# Altium schematic sheet Telemetry_System.SchDoc
size A3; PageSetup: Record=PageOptions|CenterHorizontal=True|CenterVertical=True|PrintScale=0.49|XCorrection=1.00|YCorrection=1.00|PrintKind=0|BorderSize=5000000|LeftOffset=0|BottomOffset=0|Orientation=2|PaperLength=1000|PaperWidth=1000|Scale=100|PaperSource=7|PrintQuality=600|MediaType=1|DitherType=10|PaperKind=A3|PrintScaleMode=1; SheetTitle: Sheet Title
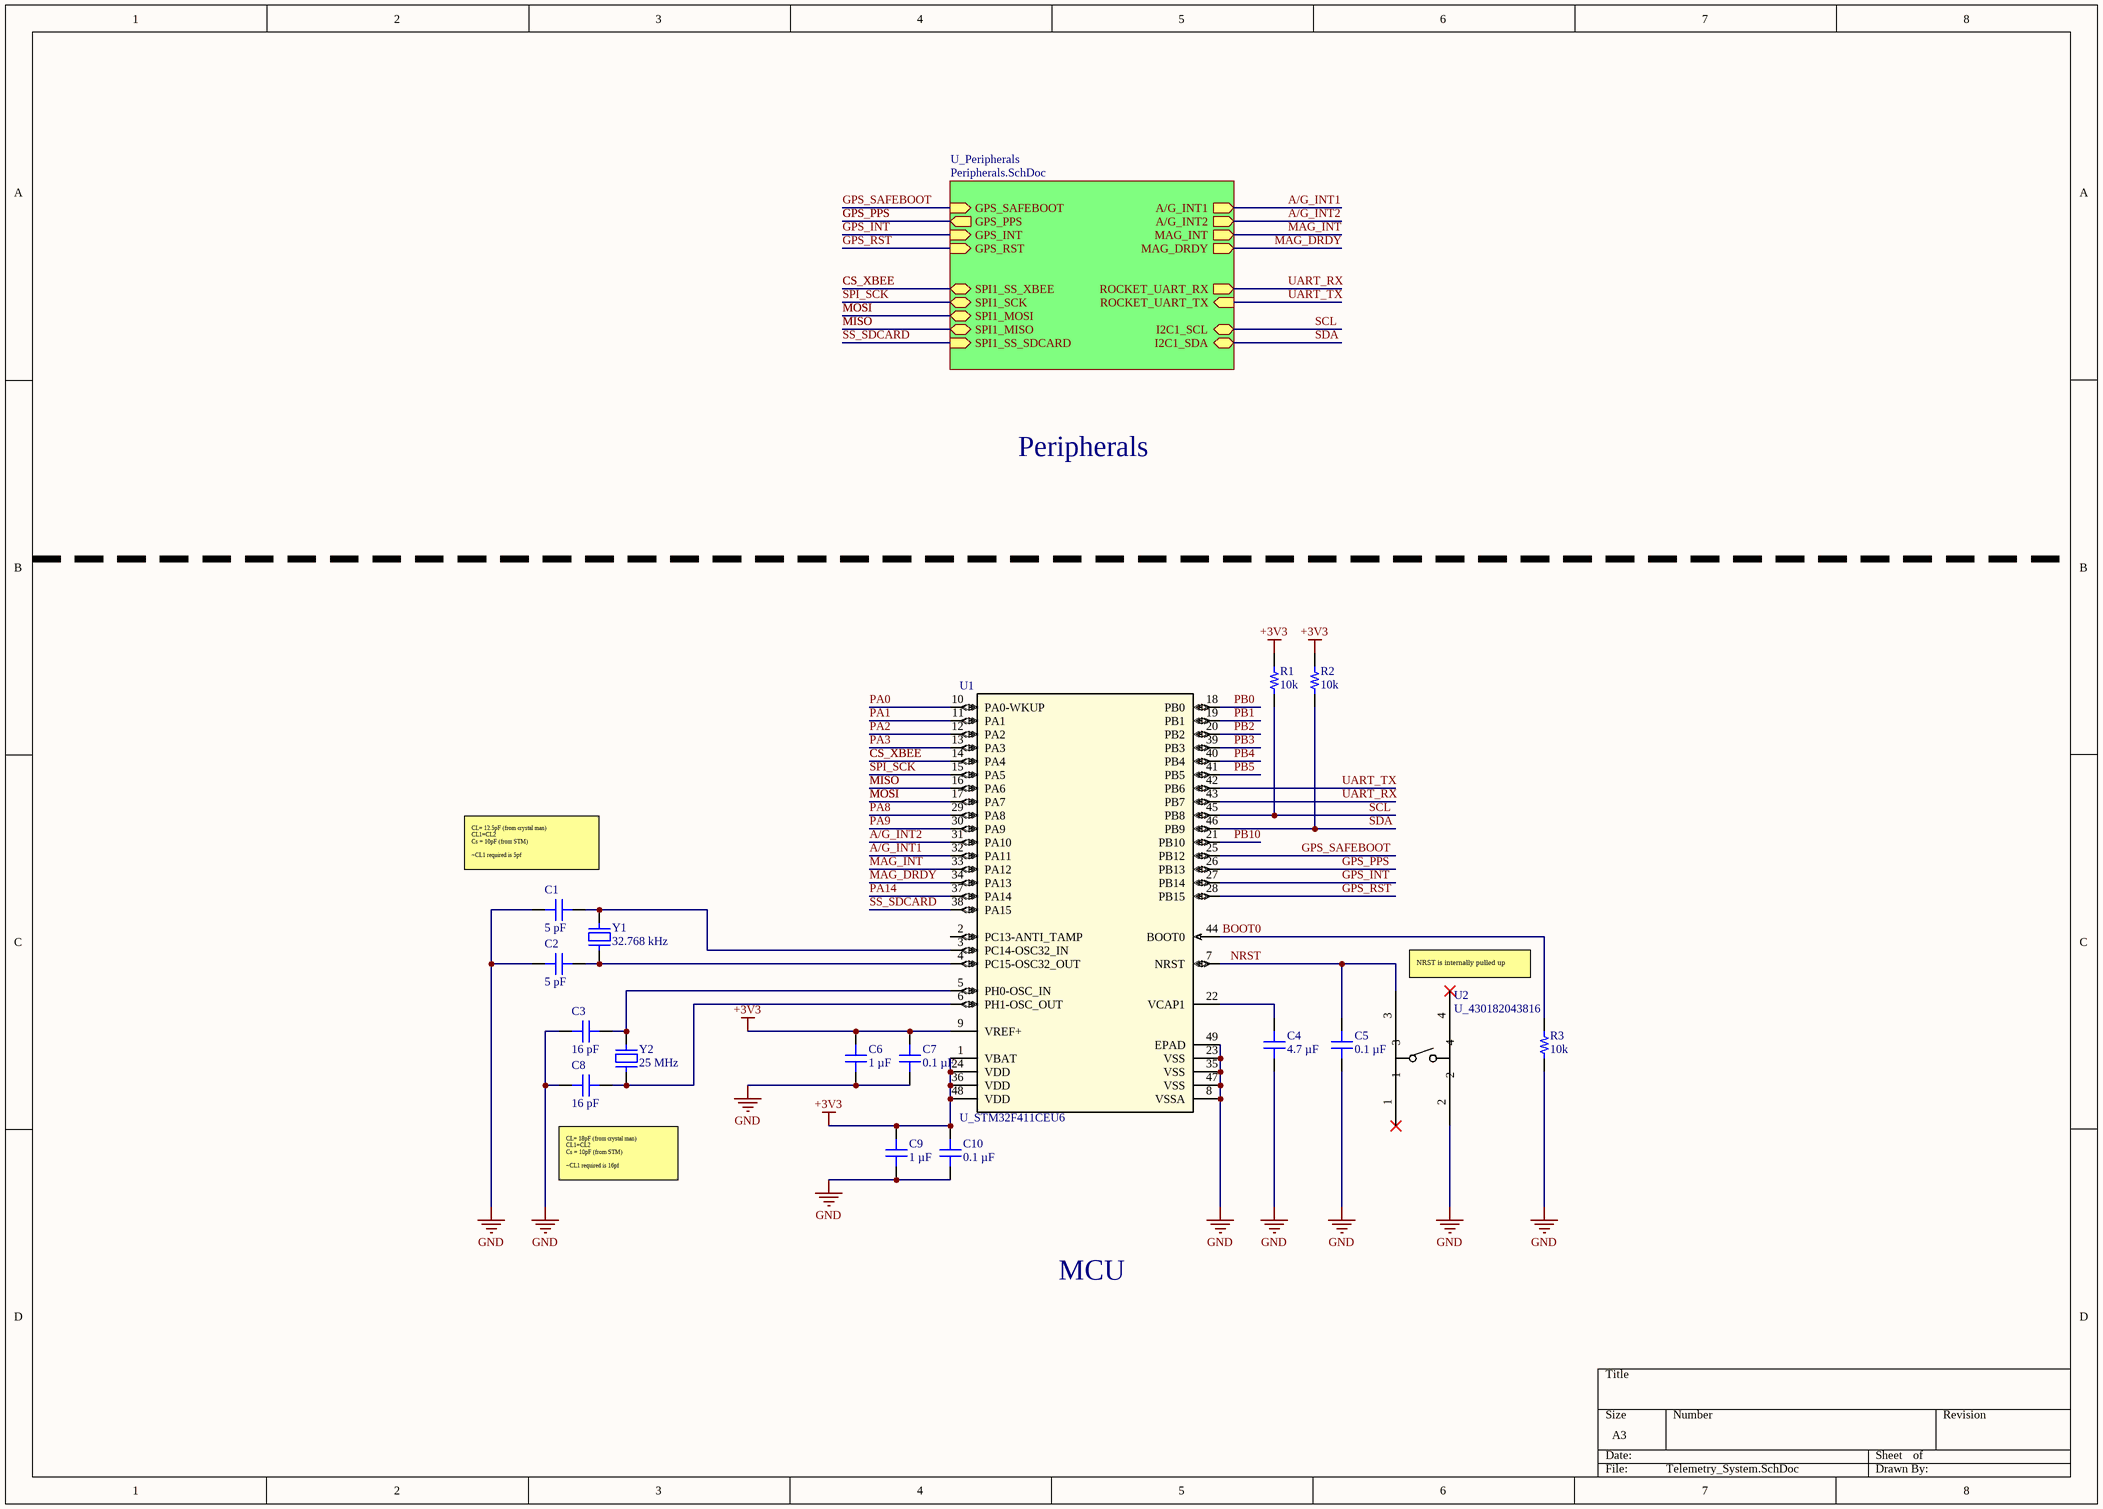
[diagram p0: Telemetry_System.SchDoc]

## Parts
C1  5 pF  [CAP 0603_1608]
C2  5 pF  [CAP 0603_1608]
C3  16 pF  [CAP 0603_1608]
C4  4.7 µF  [CAP 0603_1608]
C5  0.1 µF  [CAP 0402_1005]
C6  1 µF  [CAP 0402_1005]
C7  0.1 µF  [CAP 0402_1005]
C8  16 pF  [CAP 0603_1608]
C9  1 µF  [CAP 0402_1005]
C10  0.1 µF  [CAP 0402_1005]
R1  10k  [RES 0402_1005]
R2  10k  [RES 0402_1005]
R3  10k  [RES 0402_1005]
U1  U_STM32F411CEU6  [UFQFPN-48_7X7X0P55MM]
U2  U_430182043816  [SOIC_82043816_WRE]
Y1  32.768 kHz  [MICRO CRYSTAL CM8V H0.6mm]
Y2  25 MHz  [ABRACON ABLS]

## Sub-sheets
U_Peripherals = Peripherals.SchDoc: GPS_RST (in), GPS_PPS (out), GPS_SAFEBOOT (in), SPI1_SS_XBEE (bidir), SPI1_SCK (bidir), SPI1_MOSI (bidir), SPI1_MISO (bidir), SPI1_SS_SDCARD (in), I2C1_SCL (bidir), I2C1_SDA (bidir), ROCKET_UART_TX (in), ROCKET_UART_RX (out), MAG_DRDY (out), A/G_INT1 (out), A/G_INT2 (out), MAG_INT (out), GPS_INT (in)

## Nets
+3V3: C6.2 C7.2 C9.2 C10.2 R1.1 R2.1 U1.1(VBAT) U1.9(VREF+) U1.24(VDD) U1.36(VDD) U1.48(VDD)
GND: C1.1 C2.1 C3.1 C4.1 C5.1 C6.1 C7.1 C8.1 C9.1 C10.1 R3.2 U1.8(VSSA) U1.23(VSS) U1.35(VSS) U1.47(VSS) U1.49(EPAD) U2.2
A/G_INT1: U1.32(PA11) ; sheet U_Peripherals/A/G_INT1
A/G_INT2: U1.31(PA10) ; sheet U_Peripherals/A/G_INT2
BOOT0: R3.1 U1.44(BOOT0)
CS_XBEE: U1.14(PA4) ; sheet U_Peripherals/SPI1_SS_XBEE
GPS_INT: U1.27(PB14) ; sheet U_Peripherals/GPS_INT
GPS_PPS: U1.26(PB13) ; sheet U_Peripherals/GPS_PPS
GPS_RST: U1.28(PB15) ; sheet U_Peripherals/GPS_RST
GPS_SAFEBOOT: U1.25(PB12) ; sheet U_Peripherals/GPS_SAFEBOOT
MAG_DRDY: U1.34(PA13) ; sheet U_Peripherals/MAG_DRDY
MAG_INT: U1.33(PA12) ; sheet U_Peripherals/MAG_INT
MISO: U1.16(PA6) ; sheet U_Peripherals/SPI1_MISO
MOSI: U1.17(PA7) ; sheet U_Peripherals/SPI1_MOSI
NRST: C5.2 U1.7(NRST) U2.3
PA0: U1.10(PA0-WKUP)
PA1: U1.11(PA1)
PA2: U1.12(PA2)
PA3: U1.13(PA3)
PA8: U1.29(PA8)
PA9: U1.30(PA9)
PA14: U1.37(PA14)
PB0: U1.18(PB0)
PB1: U1.19(PB1)
PB2: U1.20(PB2)
PB3: U1.39(PB3)
PB4: U1.40(PB4)
PB5: U1.41(PB5)
PB10: U1.21(PB10)
SCL: R1.2 U1.45(PB8) ; sheet U_Peripherals/I2C1_SCL
SDA: R2.2 U1.46(PB9) ; sheet U_Peripherals/I2C1_SDA
SPI_SCK: U1.15(PA5) ; sheet U_Peripherals/SPI1_SCK
SS_SDCARD: U1.38(PA15) ; sheet U_Peripherals/SPI1_SS_SDCARD
UART_RX: U1.43(PB7) ; sheet U_Peripherals/ROCKET_UART_RX
UART_TX: U1.42(PB6) ; sheet U_Peripherals/ROCKET_UART_TX
NetC1_2: C1.2 U1.3(PC14-OSC32_IN) Y1.2
NetC2_2: C2.2 U1.4(PC15-OSC32_OUT) Y1.1
NetC3_2: C3.2 U1.5(PH0-OSC_IN) Y2.2
NetC4_2: C4.2 U1.22(VCAP1)
NetC8_2: C8.2 U1.6(PH1-OSC_OUT) Y2.1

Not connected (* = marked no-connect by the designer): U1 2(PC13-ANTI_TAMP); U2 1* 4*

## Notes on the sheet
- Peripherals
- CL= 12.5pF (from crystal man)
  CL1=CL2
  Cs = 10pF (from STM)
  ~CL1 required is 5pf
- NRST is internally pulled up
- CL= 18pF (from crystal man)
  CL1=CL2
  Cs = 10pF (from STM)
  ~CL1 required is 16pf
- MCU

## Library data of the parts
C1 C2 = CGA3E2C0G1H050C080AD: CAP CER 5PF 50V 0603 EPOXY; manufacturer: TDK Corporation; Temperature Coefficient: C0G, NP0; Tolerance: ±0.25pF; Part Number: CGA3E2C0G1H050C080AD; Value: 5 pF; Applications: Automotive; Capacitance: 5 pF; componentlink1description: Datasheet; componentlink1url: https://product.tdk.com/info/en/catalog/datasheets/mlcc_automotive_epoxy_en.pdf?ref_disty=digikey; componentlink2description: DigiKey Link; componentlink2url: https://www.digikey.com/en/products/detail/tdk-corporation/CGA3E2C0G1H050C080AD/3933530; Device Package: 0603 (1608 Metric); Features: Epoxy Mountable; lastupdated: 9/02/2024 8:10:25 PM; Lifecycle Status: Active; Minimum Order: 1; Mounting Type: Surface Mount, MLCC, Epoxy; Operating Temperature: -55°C ~ 125°C; Package / Case: 0603 (1608 Metric); packaging: TapeAndReel; partid: 6295; Part Status: Active; price: 0.02; Ratings: AEC-Q200; series: CGA; Size / Dimension: 0.063" L x 0.031" W (1.60mm x 0.80mm); Supplier 1: DigiKey; Supplier Part Number 1: 445-9797-1-ND; Thickness (Max): 0.037" (0.95mm); Voltage - Rated: 50V
C3 C8 = C0603C160K3GAC7867: CAP CER 16PF 25V C0G/NP0 0603; manufacturer: KEMET; Temperature Coefficient: C0G, NP0; Tolerance: ±10%; Part Number: C0603C160K3GAC7867; Value: 16 pF; Applications: General Purpose; Capacitance: 16 pF; componentlink1description: Datasheet; componentlink1url: https://api.kemet.com/component-edge/download/datasheet/C0603C160K3GAC7867.pdf; componentlink2description: DigiKey Link; componentlink2url: https://www.digikey.com/en/products/detail/kemet/C0603C160K3GAC7867/12701360; Device Package: 0603 (1608 Metric); Features: Low ESL; lastupdated: 9/02/2024 8:09:58 PM; Lifecycle Status: Active; Minimum Order: 1; Mounting Type: Surface Mount, MLCC; Operating Temperature: -55°C ~ 125°C; Package / Case: 0603 (1608 Metric); packaging: TapeAndReel; partid: 35523; Part Status: Active; price: 0.04; series: SMD Comm C0G; Size / Dimension: 0.063" L x 0.031" W (1.60mm x 0.80mm); Supplier 1: DigiKey; Supplier Part Number 1: 399-C0603C160K3GAC7867CT-ND; Thickness (Max): 0.034" (0.87mm); Voltage - Rated: 25V
C4 = GRM185C80J475ME11D: CAP CER 4.7UF 6.3V X6S 0603; manufacturer: Murata Electronics; Tolerance: ±20%; Part Number: GRM185C80J475ME11D; Value: 4.7 µF; Applications: General Purpose; Capacitance: 4.7 µF; componentlink1description: Datasheet; componentlink1url: https://search.murata.co.jp/Ceramy/image/img/A01X/G101/ENG/GRM185C80J475ME11-01A.pdf; componentlink2description: DigiKey Link; componentlink2url: https://www.digikey.com/en/products/detail/murata-electronics/GRM185C80J475ME11D/10326313; Device Package: 0603 (1608 Metric); lastupdated: 9/02/2024 8:10:28 PM; Lifecycle Status: Active; Minimum Order: 1; Mounting Type: Surface Mount, MLCC; Operating Temperature: -55°C ~ 105°C; Package / Case: 0603 (1608 Metric); packaging: TapeAndReel; partid: 3976; Part Status: Active; price: 0.03; series: GRM; Size / Dimension: 0.063" L x 0.031" W (1.60mm x 0.80mm); Supplier 1: DigiKey; Supplier Part Number 1: 490-18660-1-ND; Temperature Coefficient: X6S; Thickness (Max): 0.022" (0.55mm); Voltage - Rated: 6.3V
C5 C7 C10 = CL05B104KP5VPNC: CAP CER 100NF 10V X7R 0402; manufacturer: Samsung Electro-Mechanics; Tolerance: ±10%; Part Number: CL05B104KP5VPNC; Value: 0.1 µF; Applications: Automotive; Capacitance: 0.1 µF; componentlink1description: Datasheet; componentlink1url: https://mm.digikey.com/Volume0/opasdata/d220001/medias/docus/5458/CL05B104KP5VPNC_Spec.pdf; componentlink2description: DigiKey Link; componentlink2url: https://www.digikey.com/en/products/detail/samsung-electro-mechanics/CL05B104KP5VPNC/20498482; Device Package: 0402 (1005 Metric); lastupdated: 9/02/2024 8:03:17 PM; Lifecycle Status: Active; Minimum Order: 1; Mounting Type: Surface Mount, MLCC; Operating Temperature: -55°C ~ 125°C; Package / Case: 0402 (1005 Metric); packaging: TapeAndReel; partid: 56690; price: 0.01; Ratings: AEC-Q200; series: CL; Size / Dimension: 0.039" L x 0.020" W (1.00mm x 0.50mm); Supplier 1: DigiKey; Supplier Part Number 1: 1276-CL05B104KP5VPNCCT-ND; Temperature Coefficient: X7R; Thickness (Max): 0.022" (0.55mm); Voltage - Rated: 10V
C6 C9 = KGM05AR50G105KH: CAP CER 1UF 4V X5R 0402; manufacturer: KYOCERA AVX; Tolerance: ±10%; Part Number: KGM05AR50G105KH; Value: 1 µF; Applications: General Purpose; Capacitance: 1 µF; componentlink1description: Datasheet; componentlink1url: https://datasheets.kyocera-avx.com/cx5r.pdf; componentlink2description: DigiKey Link; componentlink2url: https://www.digikey.com/en/products/detail/kyocera-avx/KGM05AR50G105KH/3079858; Device Package: 0402 (1005 Metric); lastupdated: 9/02/2024 8:03:45 PM; Lifecycle Status: Active; Minimum Order: 1; Mounting Type: Surface Mount, MLCC; Operating Temperature: -55°C ~ 85°C; Package / Case: 0402 (1005 Metric); packaging: TapeAndReel; partid: 51052; Part Status: Active; price: 0.07; series: KGM - X5R; Size / Dimension: 0.039" L x 0.020" W (1.00mm x 0.50mm); Supplier 1: DigiKey; Supplier Part Number 1: 478-KGM05AR50G105KHCT-ND; Temperature Coefficient: X5R; Thickness (Max): 0.022" (0.55mm); Voltage - Rated: 4V
R1-R3 = RP73PF1E10KBTD: RES 10K OHM 0.1% 1/10W 0402; Manufacturer: TE Connectivity Passive Product; Power (Watts): 0.1W, 1/10W; Resistance: 10 kOhms; Temperature Coefficient: ±25ppm/°C; Part Number: RP73PF1E10KBTD; Value: 10k; ComponentLink1Description: Datasheet; ComponentLink1URL: https://www.te.com/commerce/DocumentDelivery/DDEController?Action=srchrtrv&DocNm=1773272&DocType=DS&DocLang=English; ComponentLink2Description: DigiKey Link; ComponentLink2URL: https://www.digikey.com/en/products/detail/te-connectivity-passive-product/RP73PF1E10KBTD/8260957; Composition: Thin Film; Device Package: 0402 (1005 Metric); Height - Seated (Max): 0.014" (0.35mm); LastUpdated: 9/02/2024 8:30:24 PM; Lifecycle Status: Active; Minimum Order: 1; Number of Terminations: 2; Operating Temperature: -55°C ~ 155°C; Package / Case: 0402 (1005 Metric); Packaging: TapeAndReel; PartId: 2434; Part Status: Active; Price: 0.08; Series: RP73, Holsworthy; Size / Dimension: 0.039" L x 0.020" W (1.00mm x 0.50mm); Supplier 1: DigiKey; Supplier Part Number 1: A127415CT-ND; Supplier Device Package: 0402; Tolerance: ±0.1%
U1 = U_STM32F411CEU6: No Description Available; Mfr_Name: STMicroelectronics; RefDes: RefDes; Type: Type
U2 = U_430182043816: No Description Available; Mfr_Name: Wurth Electronics; RefDes: RefDes; Type: Type
Y1 = CM8V-T1A-32.768KHZ-12.5PF-20PPM-TB-QA: CRYSTAL 32.7680KHZ 12.5PF SMD; Manufacturer: Micro Crystal AG; ESR (Equivalent Series Resistance): 70 kOhms; Frequency Tolerance: ±20ppm; Operating Mode: Fundamental; Part Number: CM8V-T1A-32.768KHZ-12.5PF-20PPM-TB-QA; ComponentLink1Description: Datasheet; ComponentLink1URL: https://www.microcrystal.com/fileadmin/Media/Products/32kHz/Datasheet/CM8V-T1A.pdf; ComponentLink2Description: DigiKey Link; ComponentLink2URL: https://www.digikey.com/en/products/detail/micro-crystal-ag/CM8V-T1A-32-768KHZ-12-5PF-20PPM-TB-QA/10499237; Frequency: 32.768 kHz; Height - Seated (Max): 0.024" (0.60mm); LastUpdated: 11/03/2024 8:14:55 AM; Lifecycle Status: Active; Load Capacitance: 12.5pF; Minimum Order: 1; Mounting Type: Surface Mount; Operating Temperature: -40°C ~ 125°C; Package / Case: 2-SMD, No Lead; Packaging: TapeAndReel; PartId: 839; Part Status: Active; Price: 0.32; Ratings: AEC-Q200; Series: CM8V; Size / Dimension: 0.079" L x 0.047" W (2.00mm x 1.20mm); Supplier 1: DigiKey; Supplier Part Number 1: 2195-CM8V-T1A-32.768KHZ-12.5PF-20PPM-TB-QACT-ND; Type: kHz Crystal (Tuning Fork); Value: 32.768 kHz
Y2 = ABLS-25.000MHZ-K4F-T: CRYSTAL 25.0000MHZ 18PF SMD; Manufacturer: Abracon LLC; ESR (Equivalent Series Resistance): 40 Ohms; Frequency Stability: ±50ppm; Frequency Tolerance: ±30ppm; Operating Mode: Fundamental; Part Number: ABLS-25.000MHZ-K4F-T; ComponentLink1Description: Datasheet; ComponentLink1URL: https://abracon.com/Resonators/abls.pdf; ComponentLink2Description: DigiKey Link; ComponentLink2URL: https://www.digikey.com/en/products/detail/abracon-llc/ABLS-25-000MHZ-K4F-T/2001323; Frequency: 25 MHz; Height - Seated (Max): 0.165" (4.20mm); LastUpdated: 11/03/2024 7:54:13 AM; Lifecycle Status: Active; Load Capacitance: 18pF; Minimum Order: 1; Mounting Type: Surface Mount; Operating Temperature: -40°C ~ 125°C; Package / Case: HC-49/US; Packaging: TapeAndReel; PartId: 244; Part Status: Active; Price: 0.20; Series: ABLS; Size / Dimension: 0.449" L x 0.185" W (11.40mm x 4.70mm); Supplier 1: DigiKey; Supplier Part Number 1: 535-9956-1-ND; Type: MHz Crystal; Value: 25 MHz